# Altium schematic sheet puente H rama 1.SchDoc
size A4
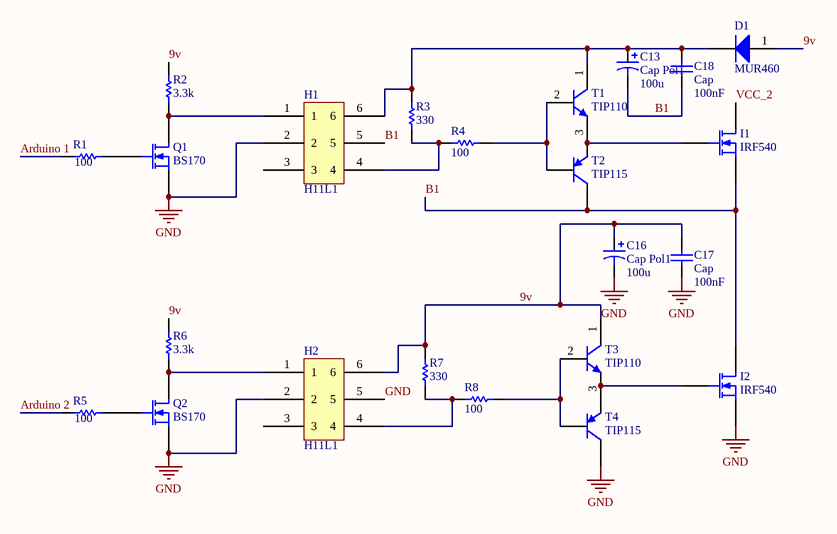
[diagram p0: puente H rama 1.SchDoc]

## Parts
C13  Cap Pol1  value 100u  [A]
C16  Cap Pol1  value 100u  [A]
C17  Cap  value 100nF  [C1206]
C18  Cap  value 100nF  [C1206]
D1  MUR460  [DO-201AD]
H1  H11L1  [DIP-6]
H2  H11L1  [DIP-6]
I1  IRF540  [TO-220AB]
I2  IRF540  [TO-220-AB]
Q1  BS170  [E3]
Q2  BS170  [E3]
R1  value 100  [3216[1206]]  (hidden comment: Res1)
R2  value 3.3k  [3216[1206]]  (hidden comment: Res1)
R3  value 330  [3216[1206]]  (hidden comment: Res1)
R4  value 100  [3216[1206]]  (hidden comment: Res1)
R5  value 100  [3216[1206]]  (hidden comment: Res1)
R6  value 3.3k  [3216[1206]]  (hidden comment: Res1)
R7  value 330  [3216[1206]]  (hidden comment: Res1)
R8  value 100  [3216[1206]]  (hidden comment: Res1)
T1  TIP110  [TO-220-AB]
T2  TIP115  [TO-220-AB]
T3  TIP110  [TO-220-AB]
T4  TIP115  [TO-220-AB]

## Nets
GND: C16.2 C17.1 H1.2 H2.2 H2.5 I2.3(S) Q1.3(S) Q2.3(S) T4.1(C)
9v: C16.1 C17.2 D1.1(A) H2.6 R2.2 R6.2 R7.2 T3.1(C)
Arduino 1: R1.1
Arduino 2: R5.1
B1: C13.2 C18.1 H1.5 I1.3(S) I2.1(D) T2.1(C)
VCC_2: I1.1(D)
NetC13_1: C13.1 C18.2 D1.2(K) H1.6 R3.2 T1.1(C)
NetH1_1: H1.1 Q1.1(D) R2.1
NetH1_4: H1.4 R3.1 R4.2
NetH2_1: H2.1 Q2.1(D) R6.1
NetH2_4: H2.4 R7.1 R8.2
NetI1_2: I1.2(G) T1.3(E) T2.3(E)
NetI2_2: I2.2(G) T3.3(E) T4.3(E)
NetQ1_2: Q1.2(G) R1.2
NetQ2_2: Q2.2(G) R5.2
NetR4_1: R4.1 T1.2(B) T2.2(B)
NetR8_1: R8.1 T3.2(B) T4.2(B)

Not connected (* = marked no-connect by the designer): H1 3; H2 3

## Library data of the parts
C13 C16 = Cap Pol1: Polarized Capacitor (Radial); Published: 8-Jun-2000; LatestRevisionDate: 17-Jul-2002; LatestRevisionNote: Re-released for DXP Platform.; PackageReference: RB7.6-15; Publisher: Altium Limited
C17 C18 = Cap: Capacitor; Published: 8-Jun-2000; LatestRevisionDate: 17-Jul-2002; LatestRevisionNote: Re-released for DXP Platform.; PackageReference: RAD-0.3; Publisher: Altium Limited
D1 = Diode: Default Diode; Published: 8-Jun-2000; LatestRevisionDate: 17-Jul-2002; LatestRevisionNote: Re-released for DXP Platform.; PackageDocument: Sep-1996; PackageReference: SMC; Publisher: Altium Limited; Code_JEDEC: DO-214-AB
I1 I2 = MOSFET-N: N-Channel MOSFET; pin to pad: 1>2 2>1; PackageDocument: 1995/1996; Published: 8-Jun-2000; LatestRevisionDate: 17-Jul-2002; LatestRevisionNote: Re-released for DXP Platform.; PackageReference: E3; Publisher: Altium Limited
Q1 Q2 = MOSFET-N: N-Channel MOSFET; PackageDocument: 1995/1996; Published: 8-Jun-2000; LatestRevisionDate: 17-Jul-2002; LatestRevisionNote: Re-released for DXP Platform.; PackageReference: E3; Publisher: Altium Limited
R1-R8 = Res1: Resistor; Published: 8-Jun-2000; LatestRevisionDate: 17-Jul-2002; LatestRevisionNote: Re-released for DXP Platform.; PackageReference: AXIAL-0.3; Publisher: Altium Limited
T1 T3 = NPN: NPN Bipolar Transistor; pin to pad: 1>2 2>1; Published: 8-Jun-2000; LatestRevisionDate: 17-Jul-2002; LatestRevisionNote: Re-released for DXP Platform.; PackageReference: TO-226; Publisher: Altium Limited; Code_JEDEC: TO-226-AA
T2 T4 = PNP: PNP Bipolar Transistor; pin to pad: 1>2 2>1; Published: 8-Jun-2000; LatestRevisionDate: 17-Jul-2002; LatestRevisionNote: Re-released for DXP Platform.; PackageReference: SOT-23B; Publisher: Altium Limited; Code_JEDEC: SOT-23